# Altium schematic sheet rotenc.SchDoc
size A4
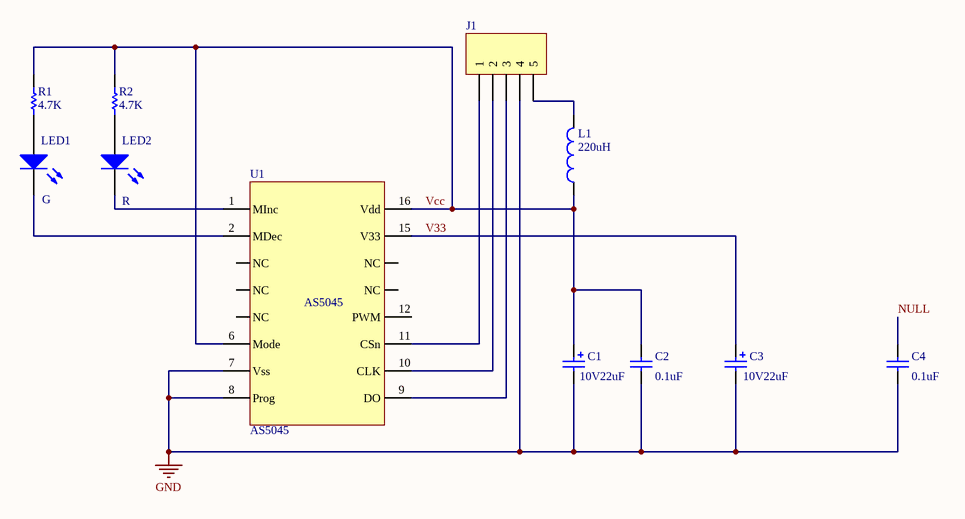
[diagram p0: rotenc.SchDoc]

## Parts
C1  10V22uF  [CAP1210P]
C2  0.1uF  [CAP0805]
C3  10V22uF  [CAP1210P]
C4  0.1uF  [CAP1210]
J1  Header 5  [J5]  (value not drawn)
L1  220uH  [IND1210]
LED1  G  [LED2G]
LED2  R  [LED2R]
R1  4.7K  [RES0805]
R2  4.7K  [RES0805]
U1  AS5045  [SSOP16]

## Nets
GND: C1.2 C2.1 C3.2 C4.1 J1.4 U1.7(Vss) U1.8(Prog)
NULL: C4.2
V33: C3.1 U1.15(V33)
Vcc: C1.1 C2.2 L1.1 R1.1 R2.1 U1.6(Mode) U1.16(Vdd)
NetJ1_1: J1.1 U1.11(CSn)
NetJ1_2: J1.2 U1.10(CLK)
NetJ1_3: J1.3 U1.9(DO)
NetJ1_5: J1.5 L1.2
NetLED1_1: LED1.1(A) R1.2
NetLED1_2: LED1.2(K) U1.2(MDec)
NetLED2_1: LED2.1(A) R2.2
NetLED2_2: LED2.2(K) U1.1(MInc)

Not connected (* = marked no-connect by the designer): U1 3(NC) 4(NC) 5(NC) 12(PWM) 13(NC) 14(NC)

## Library data of the parts
C1 C3 = Cap Pol2: Polarized Capacitor (Axial); Published: 8-Jun-2000; LatestRevisionDate: 17-Jul-2002; LatestRevisionNote: Re-released for DXP Platform.; Publisher: Altium Limited
C2 C4 = Cap: Capacitor; Published: 8-Jun-2000; LatestRevisionDate: 17-Jul-2002; LatestRevisionNote: Re-released for DXP Platform.; Publisher: Altium Limited
J1 = Header 5: Header, 5-Pin; LatestRevisionDate: 17-Jul-2002; LatestRevisionNote: Re-released for DXP Platform.; Publisher: Altium Limited
L1 = Inductor: Code_IEC: 1005; Published: 8-Jun-2000; LatestRevisionDate: 17-Jul-2002; LatestRevisionNote: Re-released for DXP Platform.; PackageReference: 0402-A; Publisher: Altium Limited; Code_JEITA: 0402
LED1 LED2 = LED: Published: 8-Jun-2000; LatestRevisionDate: 08-Jul-2005; LatestRevisionNote: Mech Layer 1 removed.; PackageReference: LED-0; Publisher: Altium Limited; PackageDescription: LED; 2 Leads
R1 R2 = Res1: Resistor; Published: 8-Jun-2000; LatestRevisionDate: 17-Jul-2002; LatestRevisionNote: Re-released for DXP Platform.; Publisher: Altium Limited
U1 = AS5045: Magnetic Rotary Encoder